# Altium project STM32+HX711.PrjPcb
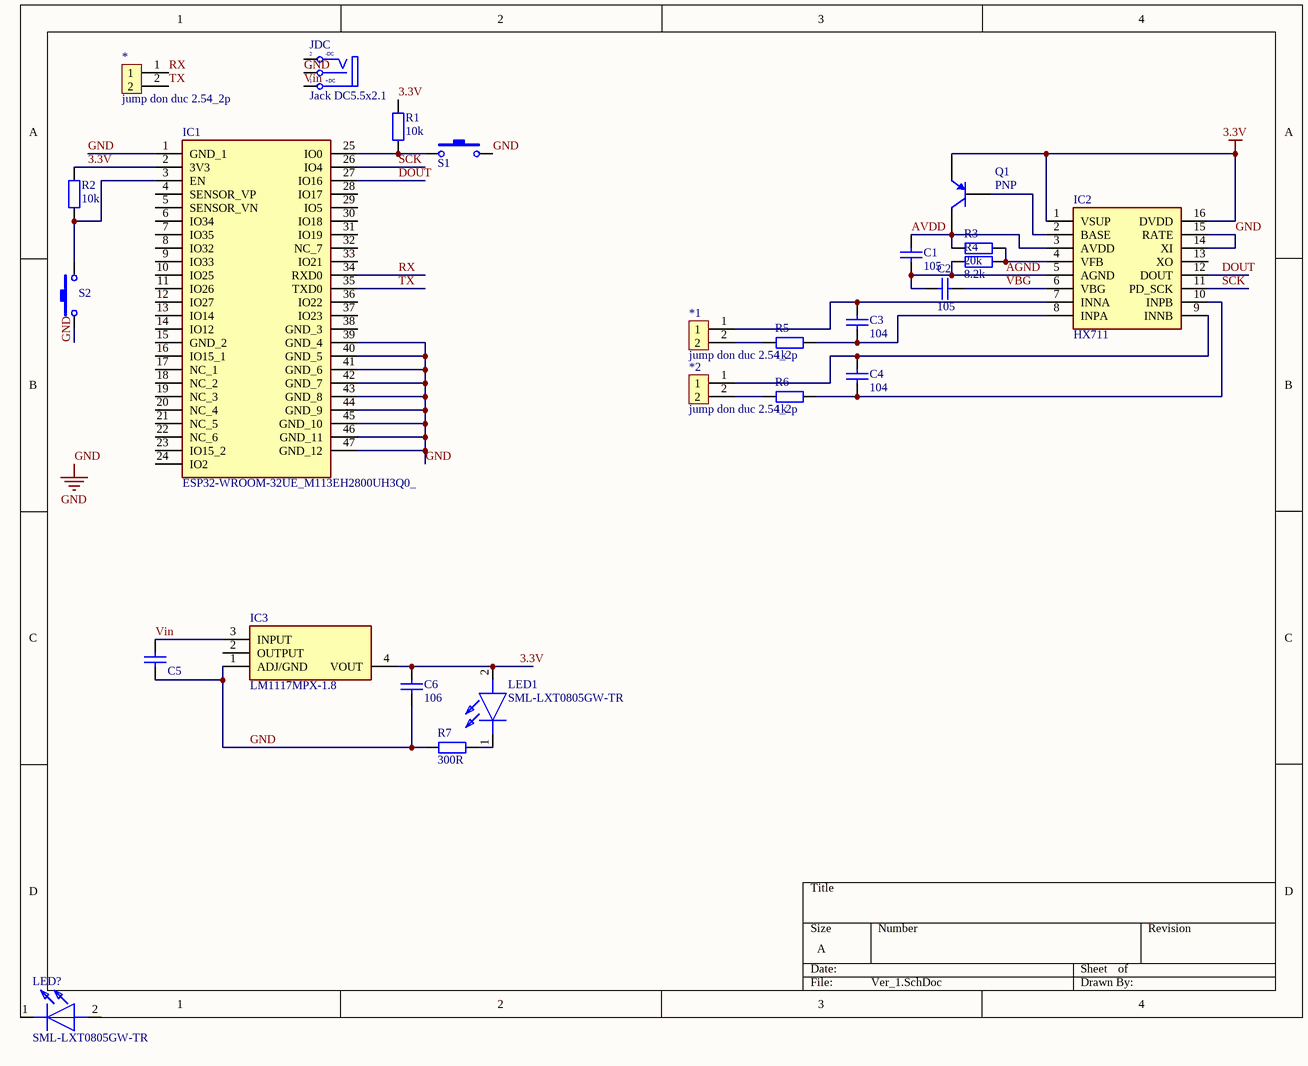
[diagram p0: Ver_1.SchDoc]
1 sheet, 25 parts. Net scope: global (net labels, ports and power ports of the same name join across sheets).
Board file: Ver_1.PcbDoc

## Sheet Ver_1.SchDoc
size A; SheetNumber: 1; SheetTotal: 1; SPICEModelCacheVAIHPODR: <root> / <DocumentId>VAIHPODR</DocumentId> / <CacheFrame Number="0"> / <Model Name="pnp" Kind="MDL"> / <Text>*Default PNP BJT / *PNP Trans Pinout: C,B,E / .MODEL PNP PNP()</Text> / </Model> / </CacheFrame> / </root>

### Parts
*  jump don duc 2.54_2p  [jump don duc_2p]
*1  jump don duc 2.54_2p  [jump don duc_2p]
*2  jump don duc 2.54_2p  [jump don duc_2p]
C1  105  [Tu 0805]
C2  105  [Tu 0805]
C3  104  [Tu 0805]
C4  104  [Tu 0805]
C5  106  [Tu 0805]  (value not drawn)
C6  106  [Tu 0805]
IC1  ESP32-WROOM-32UE_M113EH2800UH3Q0_  [ESP32WROOM32UEM113EH2800UH3Q0]
IC2  HX711  [SOIC127P600X160-16N]
IC3  LM1117MPX-1.8  [SOT230P700X180-4N]
JDC  Jack DC5.5x2.1  [DC-IN]
LED1  SML-LXT0805GW-TR  [LEDC2012X80N]
LED?  SML-LXT0805GW-TR  [LEDC2012X80N]
Q1  PNP  [SOT-23B_N]
R1  10k  [tro smd 0805]
R2  10k  [tro smd 0805]
R3  20k  [tro smd 0805]
R4  8.2k  [tro smd 0805]
R5  1k  [tro smd 0805]
R6  1k  [tro smd 0805]
R7  300R  [Tro SMD 0805]
S1  MH001036  [SW-SMD]  (value not drawn)
S2  MH001036  [SW-SMD]  (value not drawn)

### Nets
3.3V: C6.1 IC1.2(3V3) IC2.1(VSUP) IC2.16(DVDD) IC3.4(VOUT) LED1.2(A) Q1.3(E) R1.2 R2.2
GND: C5.1 C6.2 IC1.1(GND_1) IC1.39(GND_4) IC1.40(GND_5) IC1.41(GND_6) IC1.42(GND_7) IC1.43(GND_8) IC1.44(GND_9) IC1.45(GND_10) IC1.46(GND_11) IC1.47(GND_12) IC2.14(XI) IC2.15(RATE) IC3.1(ADJ/GND) JDC.3(S) R7.1 S1.1 S2.1
AGND: C1.1 C2.1 IC2.5(AGND) R4.1
AVDD: C1.2 IC2.3(AVDD) Q1.1(C) R3.1
DOUT: IC1.27(IO16) IC2.12(DOUT)
RX: *.1 IC1.34(RXD0)
SCK: IC1.26(IO4) IC2.11(PD_SCK)
TX: *.2 IC1.35(TXD0)
VBG: C2.2 IC2.6(VBG)
Vin: C5.2 IC3.3(INPUT) JDC.1(T)
Net*1_1: *1.1 C3.2 IC2.7(INNA)
Net*1_2: *1.2 R5.1
Net*2_1: *2.1 C4.2 IC2.9(INNB)
Net*2_2: *2.2 R6.1
NetC3_1: C3.1 IC2.8(INPA) R5.2
NetC4_1: C4.1 IC2.10(INPB) R6.2
NetIC1_3: IC1.3(EN) R2.1 S2.2
NetIC1_25: IC1.25(IO0) R1.1 S1.2
NetIC2_2: IC2.2(BASE) Q1.2(B)
NetIC2_4: IC2.4(VFB) R3.2 R4.2
NetLED1_1: LED1.1(K) R7.2

Not connected (* = marked no-connect by the designer): IC1 4(SENSOR_VP) 5(SENSOR_VN) 6(IO34) 7(IO35) 8(IO32) 9(IO33) 10(IO25) 11(IO26) 12(IO27) 13(IO14) 14(IO12) 15(GND_2) 16(IO15_1) 17(NC_1) 18(NC_2) 19(NC_3) 20(NC_4) 21(NC_5) 22(NC_6) 23(IO15_2) 24(IO2) 28(IO17) 29(IO5) 30(IO18) 31(IO19) 32(NC_7) 33(IO21) 36(IO22) 37(IO23) 38(GND_3); IC2 13(XO); IC3 2(OUTPUT); JDC 2(TN); LED? 1(K) 2(A)

### Notes on the sheet
- (in symbol Jac_DC) -DC; +DC

### Library data of the parts
C1 C2 = Tu 105: Dán; Ten_Linh_Kien: Tụ 0805 105-1uF 10% 50V; Don_Vi: Con; Ma_Hang: MH004552; Kieu_Chan: *; Chung_Loai: Dán; Ghi_Chu: *
C3 C4 = Tu 104: Dán; Ten_Linh_Kien: Tụ 0805 104-100nF 10% 50V; Don_Vi: Con; Ma_Hang: MH004551; Kieu_Chan: *; Chung_Loai: Dán; Ghi_Chu: *
C5 = Tu 106: Dán; Ten_Linh_Kien: Tụ 0805 106-10uF 10% 16V; Don_Vi: Con; Ma_Hang: MH004553; Chung_Loai: Dán; Ghi_Chu: *; Kieu_Chan: *
C6 = Tu 0805 106 16V 10%: Dán; Ten_Linh_Kien: Tụ 0805 106-10uF 10% 16V; So_Chan: 2; Don_Vi: Con; Ma_Hang: MH004553; Chung_Loai: Dán; Kieu_Chan: *
IC1 = ESP32-WROOM-32UE_M113EH2800UH3Q0_: Integrated Circuit; Manufacturer_Name: Espressif Systems; Manufacturer_Part_Number: ESP32-WROOM-32UE(M113EH2800UH3Q0); Datasheet Link: https://www.mouser.co.uk/datasheet/2/891/esp32_wroom_32e_esp32_wroom_32ue_datasheet_en-1855879.pdf; Height: 3.35mm; Mouser Part Number: N/A; Mouser Price/Stock: https://www.mouser.co.uk/ProductDetail/Espressif-Systems/ESP32-WROOM-32UEM113EH2800UH3Q0?qs=vHuUswq2%252BswmjMZOJoYkgw%3D%3D
IC2 = HX711: Integrated Circuit; Manufacturer_Name: AVIA; Datasheet Link: https://cdn.sparkfun.com/datasheets/Sensors/ForceFlex/hx711_english.pdf; Height: 1.6mm; Manufacturer_Part_Number: HX711
IC3 = LM1117MPX-1.8: Integrated Circuit; Manufacturer_Name: Texas Instruments; Datasheet Link: http://www.ti.com/lit/gpn/lm1117; Height: 1.8mm; Manufacturer_Part_Number: LM1117MPX-1.8; Mouser Part Number: 926-LM1117MPX-18; Mouser Price/Stock: https://www.mouser.co.uk/ProductDetail/Texas-Instruments/LM1117MPX-1.8?qs=X1J7HmVL2ZFjiBPeOqlIyg%3D%3D
JDC = Jac_DC: Cắm; Ten_Linh_Kien: Jack DC5.5x2.1MM DC5501; Ma_Hang: MH000923; Don_Vi: Con; Kieu_Chan: *; Ghi_Chu: *; Chung_Loai: Cắm
LED1 = SML-LXT0805GW-TR: LED; Manufacturer_Name: Lumex; Description: LED,0805,Surface Mount,QuasarBrite Lumex SML-LXT0805GW-TR Green LED; Datasheet Link: http://uk.rs-online.com/web/p/products/8886304; Height: 0.8mm; Manufacturer_Part_Number: SML-LXT0805GW-TR; Mouser Part Number: 696-SML-LXT0805GW; Mouser Price/Stock: https://www.mouser.co.uk/ProductDetail/Lumex/SML-LXT0805GW-TR?qs=9HInCHf8eFiVOx4SP694cA%3D%3D; Arrow Part Number: SML-LXT0805GW-TR; Arrow Price/Stock: https://www.arrow.com/en/products/sml-lxt0805gw-tr/lumex?region=nac
LED? = SML-LXT0805GW-TR: LED; Manufacturer_Name: Lumex; Datasheet Link: http://uk.rs-online.com/web/p/products/8886304; Height: 0.8mm; Manufacturer_Part_Number: SML-LXT0805GW-TR; Mouser Part Number: 696-SML-LXT0805GW; Mouser Price/Stock: https://www.mouser.co.uk/ProductDetail/Lumex/SML-LXT0805GW-TR?qs=9HInCHf8eFiVOx4SP694cA%3D%3D; Arrow Part Number: SML-LXT0805GW-TR; Arrow Price/Stock: https://www.arrow.com/en/products/sml-lxt0805gw-tr/lumex?region=nac
Q1 = PNP: PNP Bipolar Transistor; Published: 8-Jun-2000; LatestRevisionDate: 29-May-2009; LatestRevisionNote: IPC-7351 Footprint Added.; PackageVersion: Aug-1999; PackageReference: SOT-23B; Publisher: Altium Limited; PackageDescription: 3-Pin SOT-23 Package 0.95 mm Pitch, 2.4 mm Lead Span
R1 R2 = Tro 0805 1% 10k: Dán; Don_Vi: Con; So_Chan: 2; Ten_Linh_Kien: Trở 0805 1% 10k; Ma_Hang: MH005473; Chung_Loai: Dán; Kieu_Chan: *
R3 = Tro 0805 5% 20k: Dán; Don_Vi: Con; So_Chan: 2; Ten_Linh_Kien: Trở 0805 5% 20k; Ma_Hang: MH005247; Chung_Loai: Dán; Kieu_Chan: *
R4 = Tro 0805 5% 8.2k: Dán; Don_Vi: Con; So_Chan: 2; Ten_Linh_Kien: Trở 0805 5% 8.2k; Ma_Hang: MH005312; Chung_Loai: Dán; Kieu_Chan: *
R5 R6 = Tro 0805 5% 1k: Dán; Don_Vi: Con; So_Chan: 2; Ten_Linh_Kien: Trở 0805 5% 1k; Ma_Hang: MH005234; Chung_Loai: Dán; Kieu_Chan: *
R7 = Tro 0805 5% 300R: Dán; Don_Vi: Con; So_Chan: 2; Ten_Linh_Kien: Trở 0805 5% 300R; Ma_Hang: MH005335; Chung_Loai: Dán; Kieu_Chan: *
S1 S2 = SW-SMD: Dán; Value: Nút Nhấn 2 Chân 3x6x2.5MM SMD